# Altium schematic sheet Sheet1.SchDoc
size A; SheetNumber: 1; SheetTotal: 1
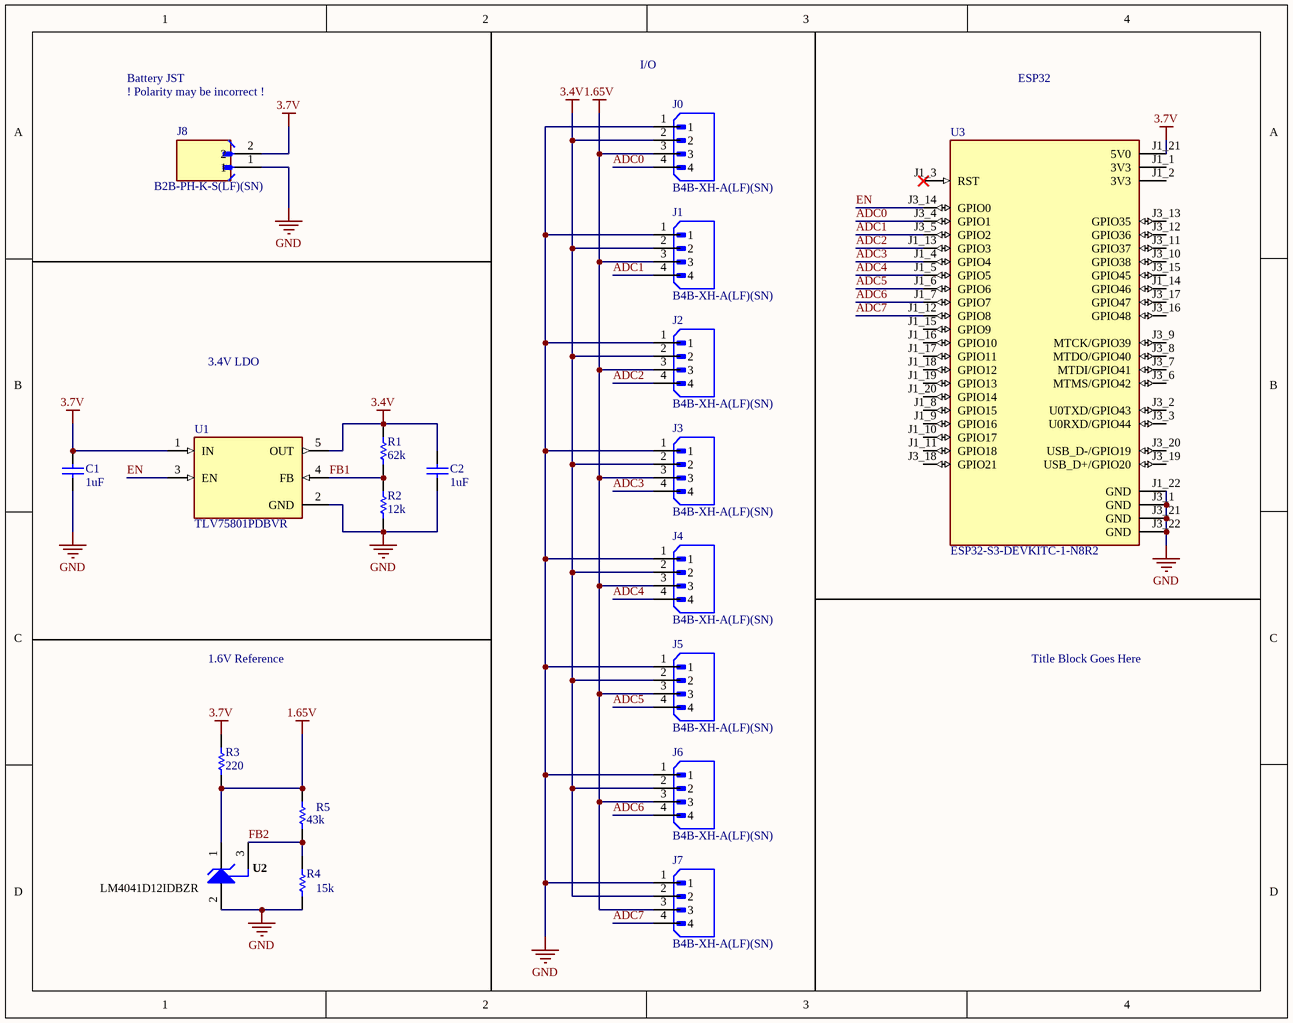
[diagram p0: Sheet1.SchDoc]

## Parts
C1  1uF  [CAPC3216X110X50LL20T25]
C2  1uF  [CAPC3216X110X50LL20T25]
J0  B4B-XH-A(LF)(SN)  [JST_B4B-XH-A(LF)(SN)]
J1  B4B-XH-A(LF)(SN)  [JST_B4B-XH-A(LF)(SN)]
J2  B4B-XH-A(LF)(SN)  [JST_B4B-XH-A(LF)(SN)]
J3  B4B-XH-A(LF)(SN)  [JST_B4B-XH-A(LF)(SN)]
J4  B4B-XH-A(LF)(SN)  [JST_B4B-XH-A(LF)(SN)]
J5  B4B-XH-A(LF)(SN)  [JST_B4B-XH-A(LF)(SN)]
J6  B4B-XH-A(LF)(SN)  [JST_B4B-XH-A(LF)(SN)]
J7  B4B-XH-A(LF)(SN)  [JST_B4B-XH-A(LF)(SN)]
J8  B2B-PH-K-S(LF)(SN)  [JST_B2B-PH-K-S(LF)(SN)]
R1  62k  [RESC3216X70X50LL20T25]
R2  12k  [RESC3216X70X50NL20T25]
R3  220  [RESC3216X60X45ML10T20]
R4  15k  [RESC3216X60X45LL10T20]
R5  43k  [RESC1206(3216)_N]
U1  TLV75801PDBVR  [SOT95P280X145-5N]
U2  LM4041D12IDBZR  [DBZ0003A_L]
U3  ESP32-S3-DEVKITC-1-N8R2  [XCVR_ESP32-S3-DEVKITC-1-N8R2]

## Nets
1.65V: J0.3 J1.3 J2.3 J3.3 J4.3 J5.3 J6.3 J7.3 R3.2 R5.2 U2.1(CATHODE)
3.4V: C2.1 J0.2 J1.2 J2.2 J3.2 J4.2 J5.2 J6.2 J7.2 R1.2 U1.5(OUT)
3.7V: C1.2 J8.2 R3.1 U1.1(IN) U3.J1_21(5V0)
GND: C1.1 C2.2 J0.1 J1.1 J2.1 J3.1 J4.1 J5.1 J6.1 J7.1 J8.1 R2.1 R4.1 U1.2(GND) U2.2(ANODE) U3.J1_22(GND) U3.J3_1(GND) U3.J3_21(GND) U3.J3_22(GND)
ADC0: J0.4 U3.J3_4(GPIO1)
ADC1: J1.4 U3.J3_5(GPIO2)
ADC2: J2.4 U3.J1_13(GPIO3)
ADC3: J3.4 U3.J1_4(GPIO4)
ADC4: J4.4 U3.J1_5(GPIO5)
ADC5: J5.4 U3.J1_6(GPIO6)
ADC6: J6.4 U3.J1_7(GPIO7)
ADC7: J7.4 U3.J1_12(GPIO8)
EN: U1.3(EN) U3.J3_14(GPIO0)
FB1: R1.1 R2.2 U1.4(FB)
FB2: R4.2 R5.1 U2.3(NC)

Not connected (* = marked no-connect by the designer): U3 J1_1(3V3) J1_2(3V3) J1_3(RST)* J1_8(GPIO15) J1_9(GPIO16) J1_10(GPIO17) J1_11(GPIO18) J1_14(GPIO46) J1_15(GPIO9) J1_16(GPIO10) J1_17(GPIO11) J1_18(GPIO12) J1_19(GPIO13) J1_20(GPIO14) J3_2(U0TXD/GPIO43) J3_3(U0RXD/GPIO44) J3_6(MTMS/GPIO42) J3_7(MTDI/GPIO41) J3_8(MTDO/GPIO40) J3_9(MTCK/GPIO39) J3_10(GPIO38) J3_11(GPIO37) J3_12(GPIO36) J3_13(GPIO35) J3_15(GPIO45) J3_16(GPIO48) J3_17(GPIO47) J3_18(GPIO21) J3_19(USB_D+/GPIO20) J3_20(USB_D-/GPIO19)

## Notes on the sheet
- ! Polarity may be incorrect !
- Battery JST
- I/O
- ESP32
- 3.4V LDO
- 1.6V Reference
- Title Block Goes Here

## Library data of the parts
C1 C2 = CMP-2000-06011-1: Chip Capacitor, 1 uF, +/- 10%, 50 V, -55 to 125 degC, 1206 (3216 Metric), RoHS, Tape and Reel; Manufacturer: Kemet; Case Height: 1mm; Dielectric: X7R; Voltage Rating: 50V; Temperature Coefficient / Code: +/-15%; Case Length: 3.2mm; Case Width: 1.6mm; Type: SMDMLCCX7R6.3-250VDCCommericalGrade; Class: Class1; Capacitance - nF: 1000nF; Datasheet URL: http://www.kemet.com/docfinder?Partnumber=C1206C105K5RACTU; Product Category: MultilayerCeramicCapacitorsMLCC-SMD/SMT; Capacitance: 1uF; Termination Style: SMD/SMT; Dimensions: 1.6mmWx3.2mmLx1mmH; Voltage Rating DC: 50V; Datasheet Version: 02/2016; Packaging: Reel; Brand: Kemet; RoHS: Details; Minimum Operating Temperature: -55C; Operating Temperature Range: -55Cto+125C; Package Reference: 1206; Manufacturer URL: http://www.kemet.com/; Product: GeneralTypeMLCCs; Tolerance: 10%; Package Description: 2-Pin Surface Mount Device, Body 3.2 x 1.6 mm; Mounting Technology: SurfaceMount; Case Code - mm: 3216; Maximum Operating Temperature: +125C; Series: C1206C; Factory Pack Quantity: 2500; Package / Case: 1206(3216metric); Case Code - in: 1206
J0-J7 = B4B-XH-A(LF)(SN): Connector Header Through Hole 4 position 0.098 (2.50mm); MF: JST Sales; SnapEDA_Link: https://www.snapeda.com/parts/B4B-XH-A(LF)(SN)/JST+Sales+America+Inc./view-part/?ref=snap; Package: None; Value: *; MP: B4B-XH-A(LF)(SN); Check_prices: https://www.snapeda.com/parts/B4B-XH-A(LF)(SN)/JST+Sales+America+Inc./view-part/?ref=eda
J8 = B2B-PH-K-S(LF)(SN): Connector Header Through Hole 2 position 0.079 (2.00mm); MF: JST; SnapEDA_Link: https://www.snapeda.com/parts/B2B-PH-K-S%20(LF)(SN)/JST/view-part/?ref=snap; Package: None; Value: *; MP: B2B-PH-K-S (LF)(SN); Check_prices: https://www.snapeda.com/parts/B2B-PH-K-S%20(LF)(SN)/JST/view-part/?ref=eda
R1 = CMP-2003-04487-1: Part Number: ERA8AEB623V; Manufacturer: Panasonic
R2 = CMP-2003-04416-1: Part Number: ERA8AEB123V; Manufacturer: Panasonic
R3 = CMP-2003-01956-1: Manufacturer: Vishay Dale; Part Number: CRCW1206220RFKEA
R4 = CMP-2003-01817-1: Part Number: CRCW120615K0FKEA; Manufacturer: Vishay Dale
R5 = CMP-1014-00113-1: 43K 0.25W 5% 1206 (3216 Metric)  SMD; Case-EIA: 1206; Case-Metric: 3216; Value: 43000.00 Ohm; Tolerance: 5 %; Technology: SMT; Power: 0.25 W
U1 = TLV75801PDBVR: 500-mA, low-IQ, high-accuracy, adjustable ultra-low-dropout voltage regulator with enable; MF: Texas Instruments; SnapEDA_Link: https://www.snapeda.com/parts/TLV75801PDBVR/Texas+Instruments/view-part/?ref=snap; Package: SOT-23-5 Texas Instruments; Value: *; MP: TLV75801PDBVR; Check_prices: https://www.snapeda.com/parts/TLV75801PDBVR/Texas+Instruments/view-part/?ref=eda
U2 = CMP-0366-00846-2: Precision Micropower Shunt Voltage Reference, 1.0% accuracy, 1.225 V, 15 ppm / degC, 12 mA, -40 to 85 degC, 3-pin SOT-23 (DBZ), Green (RoHS & no Sb/Br); Manufacturer: Texas Instruments; Iout/Iz(Max)(mA): 12; Temp Coeff(Typ)(ppm/ degree C): 15; Initial Accuracy @ 25/deg C(%): 1; Min Iz for Regulation(uA): 60; Temp Coeff(Max)(ppm/ degree C): 150; VO(V): 1.225; Rating: Catalog; Code_JEDEC: TO-236; ComponentLink3URL: http://www.ti.com/litv/pdf/mpds108a; ComponentLink2Description: Datasheet; ComponentLink2URL: http://www.ti.com/general/docs/lit/getliterature.tsp?genericPartNumber=LM4041D12&fileType=pdf; ComponentLink1Description: Manufacturer URL; ComponentLink3Description: Package Specification; Mounting Technology: Surface Mount; Eco-Plan: Green (RoHS & no Sb/Br); PackageDescription: 3-Pin Plastic Small Outline, Body 2.92 x 1.3 mm, Pitch 0.95 mm; PartNumber: LM4041D12IDBZR; PackageVersion: 4203227/B; ComponentLink1URL: http://www.ti.com/; PackageReference: DBZ0003A; DatasheetVersion: SLCS146E; SubFamily: Shunt Voltage Reference
U3 = ESP32-S3-DEVKITC-1-N8R2: WiFi Development Tools - 802.11 (Engineering Samples Only) ESP32-S3 General-Purpose Development Board, ESP32-S3-WROOM-1-N8R2, with Pin Header; MF: Espressif Systems; SnapEDA_Link: https://www.snapeda.com/parts/ESP32-S3-DEVKITC-1-N8R2/Espressif+Systems/view-part/?ref=snap; Package: None; Value: *; MP: ESP32-S3-DEVKITC-1-N8R2; Check_prices: https://www.snapeda.com/parts/ESP32-S3-DEVKITC-1-N8R2/Espressif+Systems/view-part/?ref=eda